# EAGLE design IOR8 (EAGLE 6.5.0)
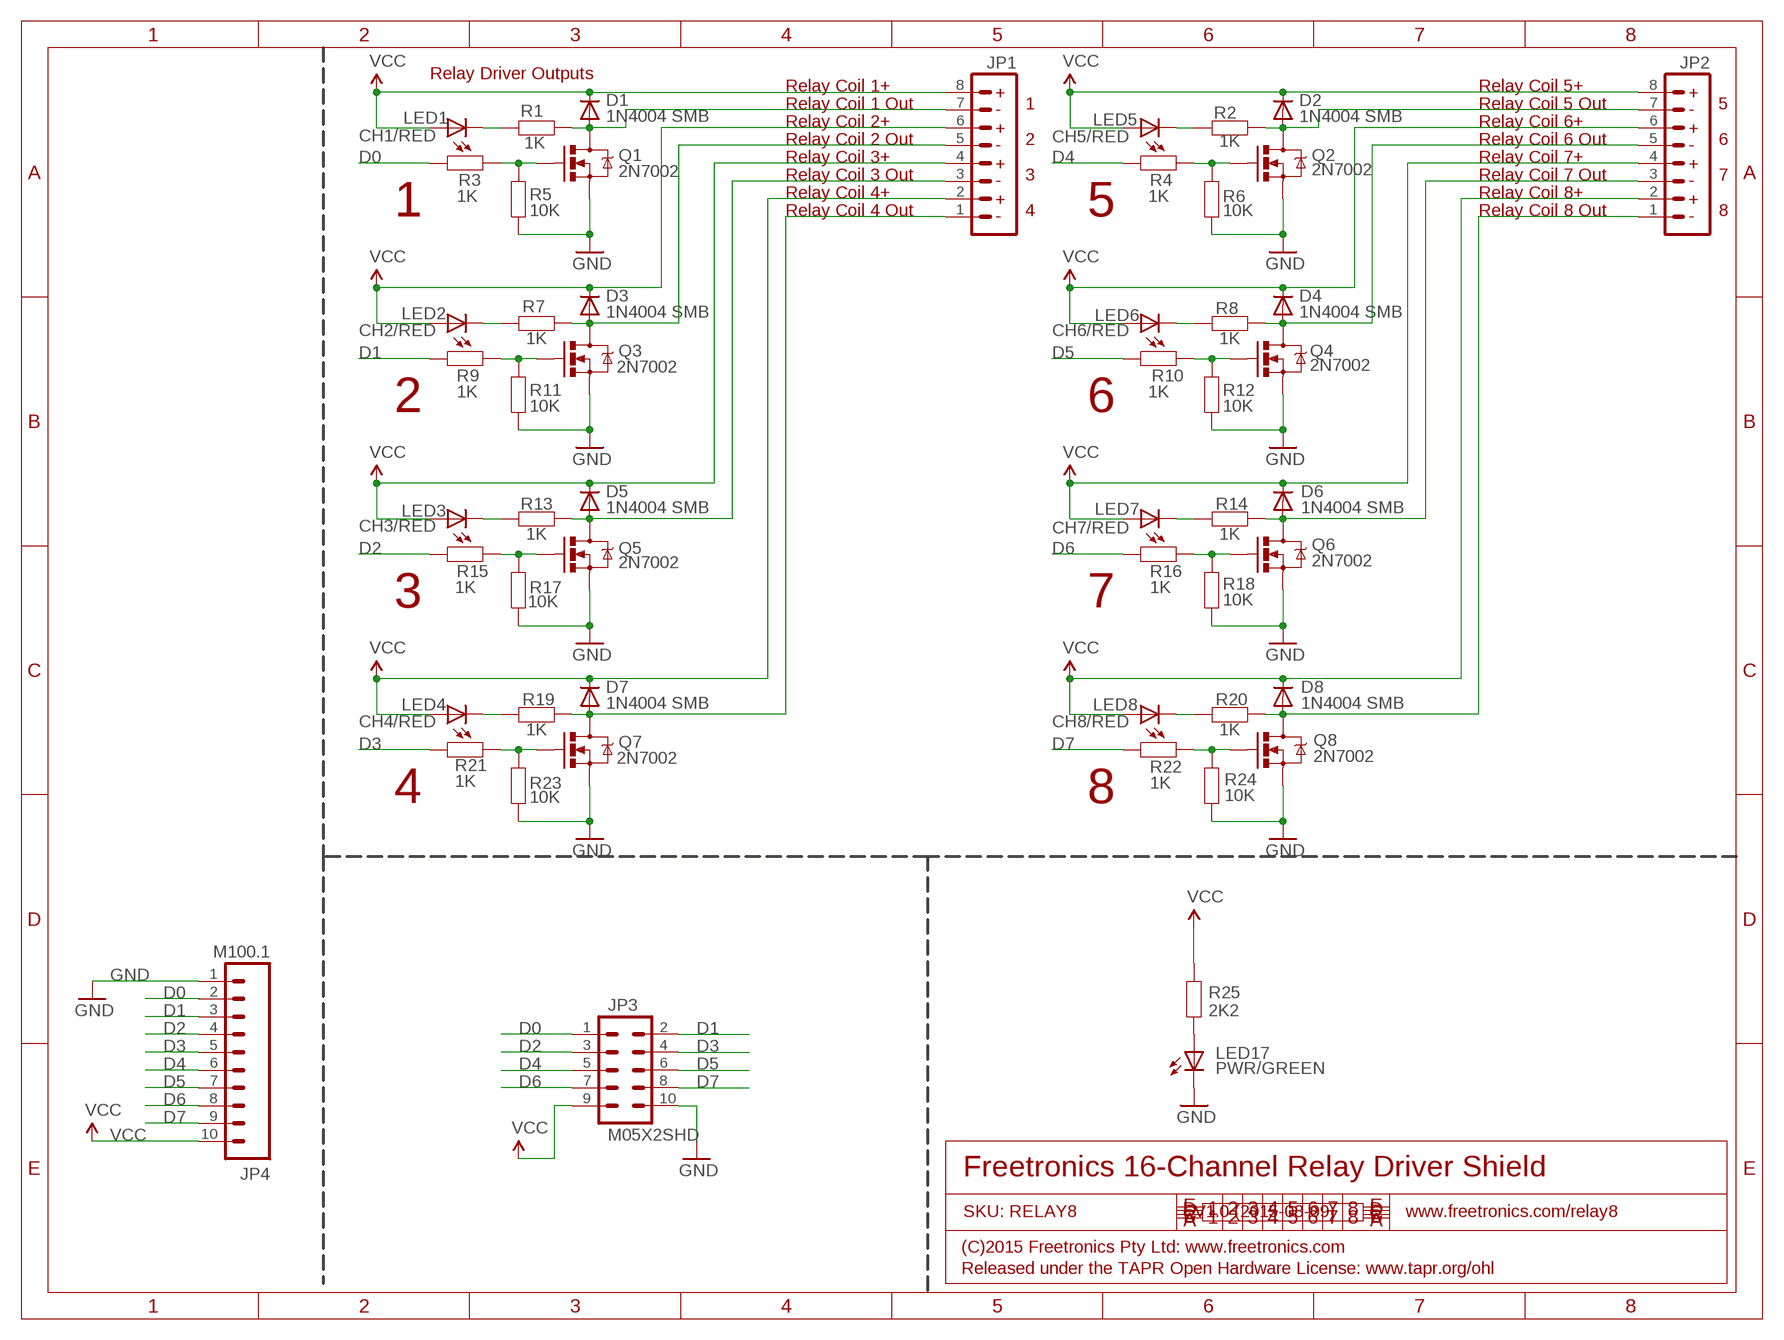
[diagram p0: schematic, sheet 1]

## Parts
D1  1N4004 SMB  DIODESMB  [SMB-DIODE]
D2  1N4004 SMB  DIODESMB  [SMB-DIODE]
D3  1N4004 SMB  DIODESMB  [SMB-DIODE]
D4  1N4004 SMB  DIODESMB  [SMB-DIODE]
D5  1N4004 SMB  DIODESMB  [SMB-DIODE]
D6  1N4004 SMB  DIODESMB  [SMB-DIODE]
D7  1N4004 SMB  DIODESMB  [SMB-DIODE]
D8  1N4004 SMB  DIODESMB  [SMB-DIODE]
JP1  M08  [TERMINALBLOCK_3.5MM_8]
JP2  M08  [TERMINALBLOCK_3.5MM_8]
JP3  M05X2SHD  [2X5-SHROUDED]
JP4  M100.1  [1X10]
LED1  CH1/RED  LED0603  [LED-0603]
LED2  CH2/RED  LED0603  [LED-0603]
LED3  CH3/RED  LED0603  [LED-0603]
LED4  CH4/RED  LED0603  [LED-0603]
LED5  CH5/RED  LED0603  [LED-0603]
LED6  CH6/RED  LED0603  [LED-0603]
LED7  CH7/RED  LED0603  [LED-0603]
LED8  CH8/RED  LED0603  [LED-0603]
LED17  PWR/GREEN  LED0603  [LED-0603]
Q1  2N7002  MOSFET-NCHANNELSMD  [SOT23-3]
Q2  2N7002  MOSFET-NCHANNELSMD  [SOT23-3]
Q3  2N7002  MOSFET-NCHANNELSMD  [SOT23-3]
Q4  2N7002  MOSFET-NCHANNELSMD  [SOT23-3]
Q5  2N7002  MOSFET-NCHANNELSMD  [SOT23-3]
Q6  2N7002  MOSFET-NCHANNELSMD  [SOT23-3]
Q7  2N7002  MOSFET-NCHANNELSMD  [SOT23-3]
Q8  2N7002  MOSFET-NCHANNELSMD  [SOT23-3]
R1  1K  RESISTOR0603  [0603]
R2  1K  RESISTOR0603  [0603]
R3  1K  RESISTOR0603  [0603]
R4  1K  RESISTOR0603  [0603]
R5  10K  RESISTOR0603  [0603]
R6  10K  RESISTOR0603  [0603]
R7  1K  RESISTOR0603  [0603]
R8  1K  RESISTOR0603  [0603]
R9  1K  RESISTOR0603  [0603]
R10  1K  RESISTOR0603  [0603]
R11  10K  RESISTOR0603  [0603]
R12  10K  RESISTOR0603  [0603]
R13  1K  RESISTOR0603  [0603]
R14  1K  RESISTOR0603  [0603]
R15  1K  RESISTOR0603  [0603]
R16  1K  RESISTOR0603  [0603]
R17  10K  RESISTOR0603  [0603]
R18  10K  RESISTOR0603  [0603]
R19  1K  RESISTOR0603  [0603]
R20  1K  RESISTOR0603  [0603]
R21  1K  RESISTOR0603  [0603]
R22  1K  RESISTOR0603  [0603]
R23  10K  RESISTOR0603  [0603]
R24  10K  RESISTOR0603  [0603]
R25  2K2  RESISTOR0603  [0603]

## Nets
D0: JP3.1 JP4.2 R3.2
D1: JP3.2 JP4.3 R9.2
D2: JP3.3 JP4.4 R15.2
D3: JP3.4 JP4.5 R21.2
D4: JP3.5 JP4.6 R4.2
D5: JP3.6 JP4.7 R10.2
D6: JP3.7 JP4.8 R16.2
D7: JP3.8 JP4.9 R22.2
GND: JP3.10 JP4.1 LED17.C Q1.2(S) Q2.2(S) Q3.2(S) Q4.2(S) Q5.2(S) Q6.2(S) Q7.2(S) Q8.2(S) R5.1 R6.1 R11.1 R12.1 R17.1 R18.1 R23.1 R24.1
N$1: Q1.1(G) R3.1 R5.2
N$3: D3.A JP1.5 Q3.3(D) R7.2
N$4: LED17.A R25.1
N$5: D1.A JP1.7 Q1.3(D) R1.2
N$8: Q3.1(G) R9.1 R11.2
N$9: D5.A JP1.3 Q5.3(D) R13.2
N$10: Q5.1(G) R15.1 R17.2
N$11: D7.A JP1.1 Q7.3(D) R19.2
N$12: Q7.1(G) R21.1 R23.2
N$13: D2.A JP2.7 Q2.3(D) R2.2
N$14: Q2.1(G) R4.1 R6.2
N$15: D4.A JP2.5 Q4.3(D) R8.2
N$16: Q4.1(G) R10.1 R12.2
N$17: D6.A JP2.3 Q6.3(D) R14.2
N$18: Q6.1(G) R16.1 R18.2
N$19: D8.A JP2.1 Q8.3(D) R20.2
N$20: Q8.1(G) R22.1 R24.2
N$21: LED2.C R7.1
N$22: LED4.C R19.1
N$23: LED3.C R13.1
N$24: LED1.C R1.1
N$25: LED5.C R2.1
N$26: LED6.C R8.1
N$27: LED7.C R14.1
N$28: LED8.C R20.1
VCC: D1.C D2.C D3.C D4.C D5.C D6.C D7.C D8.C JP1.2 JP1.4 JP1.6 JP1.8 JP2.2 JP2.4 JP2.6 JP2.8 JP3.9 JP4.10 LED1.A LED2.A LED3.A LED4.A LED5.A LED6.A LED7.A LED8.A R25.2

## Notes on the sheet
- Relay Driver Outputs
- Relay Coil 1+ | Relay Coil 5+
- + | +
- Relay Coil 1 Out | 1 | Relay Coil 5 Out | 5
- - | -
- Relay Coil 2+ | Relay Coil 6+
- + | +
- Relay Coil 2 Out | 2 | Relay Coil 6 Out | 6
- - | -
- Relay Coil 3+ | Relay Coil 7+
- + | +
- Relay Coil 3 Out | 3 | Relay Coil 7 Out | 7
- - | -
- Relay Coil 4+ | Relay Coil 8+
- + | +
- 1 | Relay Coil 4 Out | 4 | 5 | Relay Coil 8 Out | 8
- - | -
- 2 | 6
- 3 | 7
- 4 | 8
- Freetronics 16-Channel Relay Driver Shield
- SKU: RELAY8 | V1.0 (2015-03-09) | www.freetronics.com/relay8
- (C)2015 Freetronics Pty Ltd: www.freetronics.com
- Released under the TAPR Open Hardware License: www.tapr.org/ohl

## Library data of the parts
D1-D8 = freetronics-master-v1.1:DIODE: Diode These are standard reverse protection diodes and small signal diodes. SMA package can handle up to about 1A. SOD-323 can handle about 200mA. What the SOD-323 package when ordering, there are some mfgs out there that are 5-pin packages.
JP1 JP2 = freetronics-master-v1:M08: Header 8 Standard 8-pin 0.1" header. Use with straight break away headers (SKU : PRT-00116), right angle break away headers (PRT-00553), swiss pins (PRT-00743), machine pins (PRT-00117), and female headers (PRT-00115).
JP3 = freetronics-original:M05X2: Header 5x2 Standard 10-pin dual row 0.1" header. Commonly used with AVR-ISP. Use with Spark Fun Electronics SKU: PRT-00778
JP4 = freetronics-original:M10: Header 10 Standard 10-pin 0.1" header. Use with straight break away headers (SKU : PRT-00116), right angle break away headers (PRT-00553), swiss pins (PRT-00743), machine pins (PRT-00117), and female headers (PRT-00115).
LED1-LED8 LED17 = freetronics-master-v1:LED: LEDs Standard schematic elements and footprints for 5mm, 3mm, 1206, and 0603 sized LEDs. 5mm - Spark Fun Electronics SKU : COM-00529 (and others)
Q1-Q8 = freetronics-master-v1:MOSFET-NCHANNEL
R1-R25 = freetronics-master-v1:RESISTOR: Resistor Basic schematic elements and footprints for 0603, 1206, and PTH 1/10th watt (small) resistors.

## Board
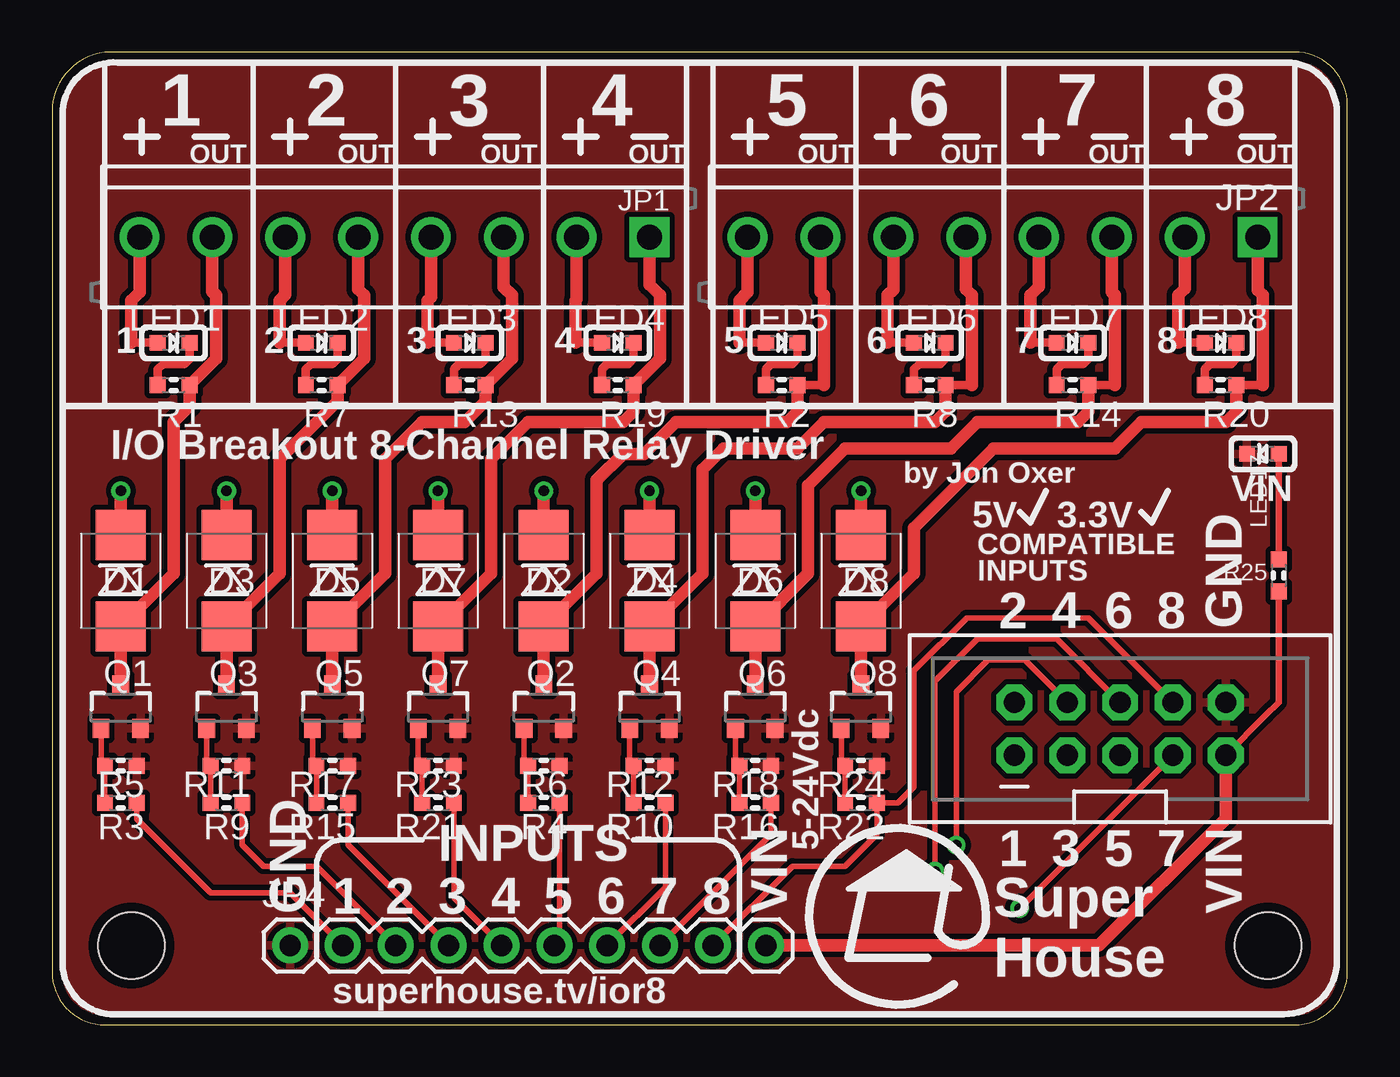
[diagram p1: board, top side]
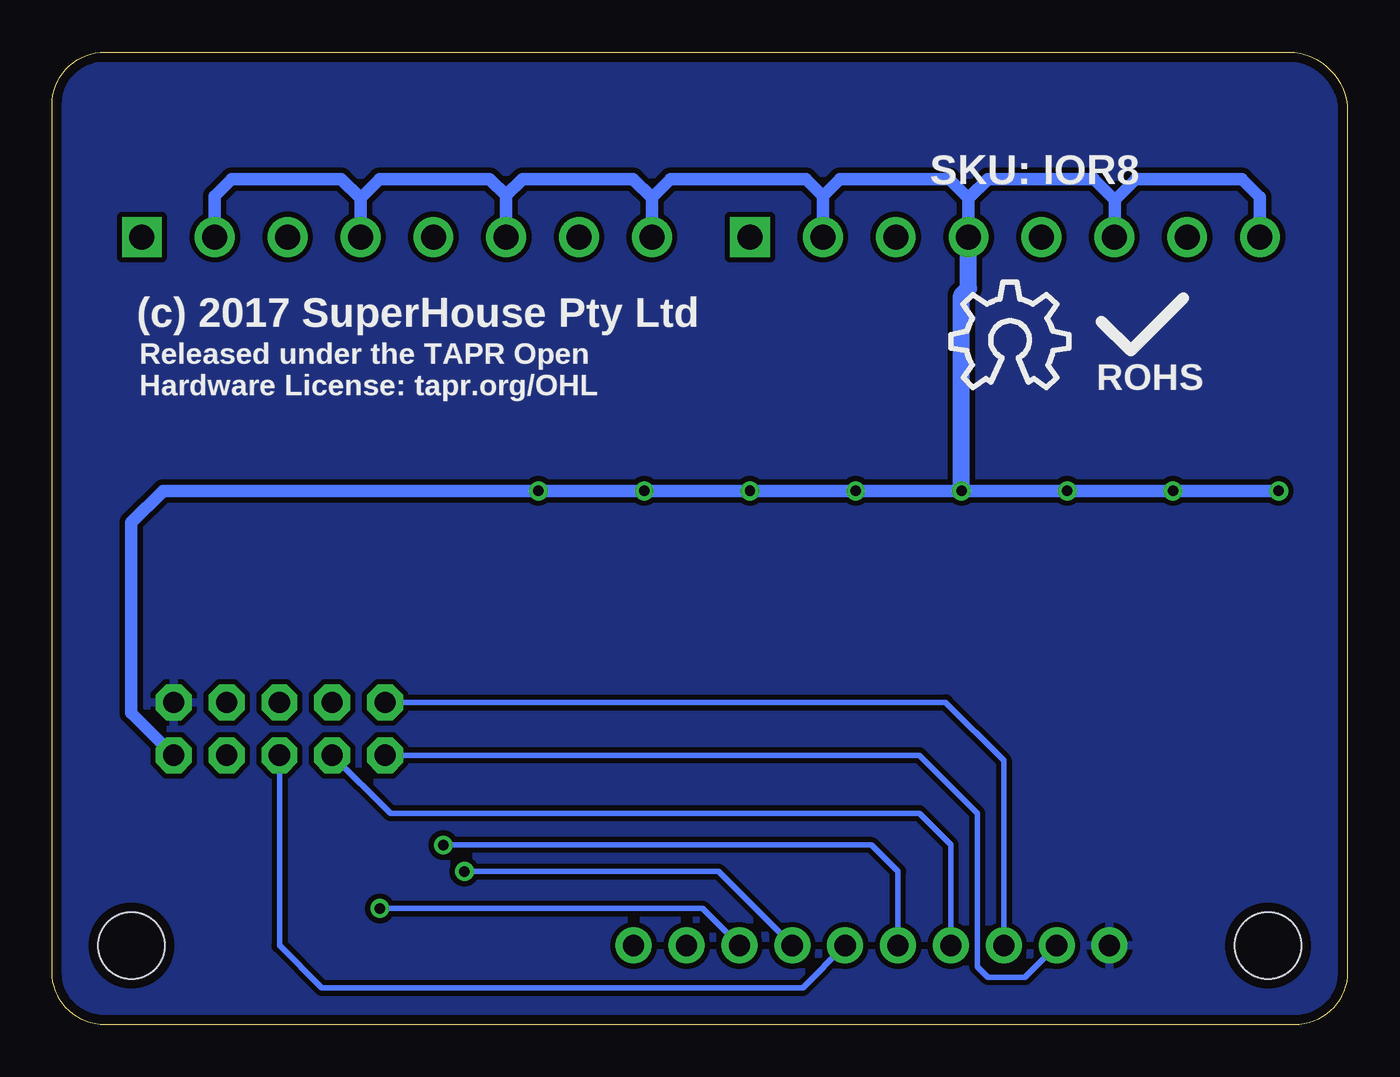
[diagram p2: board, bottom side, seen from below]

Size 62.23 x 46.74 mm. Coordinates in mm from the lower left corner, seen from the top.
Outline: 0,2.54 arc90 2.54,0 59.69,0 arc90 62.23,2.54 62.23,44.2 arc90 59.69,46.74 2.54,46.74 arc74 0,44.2 0,2.54
Copper layers (1*16): Top 0.035mm / dielectric 1.5mm / Bottom 0.035mm
Design rules "default *": minimum track width 10mil, minimum drill 19mil, track to track 10mil, track to pad 12mil, pad to pad 12mil, via to via 12mil, smd to smd 8mil, copper to edge 18mil, drill to drill 8mil, minimum pad ring 14mil, minimum via ring 8mil, stop-mask expansion 4mil, vias tented up to drill 0mil, thermal gap 10mil
Holes 3.2 mm at 3.81,3.81 58.42,3.81

### Footprints (pad centres in the part's own frame; a part is rotated, then mirrored left to right if it is on the bottom)
SMB-DIODE = smd 2.4 x 2.4: A 2.2,0; C -2.2,0
TERMINALBLOCK_3.5MM_8 = drill 1.2 square: 1 0,0 | drill 1.2: 2 3.5,0; 3 7,0; 4 10.5,0; 5 14,0; 6 17.5,0; 7 21,0; 8 24.5,0
2X5-SHROUDED = drill 1.016 octagon: 1 -1.27,5.08; 2 1.27,5.08; 3 -1.27,2.54; 4 1.27,2.54; 5 -1.27,0; 6 1.27,0; 7 -1.27,-2.54; 8 1.27,-2.54; 9 -1.27,-5.08; 10 1.27,-5.08
1X10 = drill 1.016: 1 0,0; 2 2.54,0; 3 5.08,0; 4 7.62,0; 5 10.16,0; 6 12.7,0; 7 15.24,0; 8 17.78,0; 9 20.32,0; 10 22.86,0
LED-0603 = smd 0.762 x 0.762: A -0.762,0; C 0.762,0
SOT23-3 = smd 0.8 x 0.9: 1 -0.95,-1; 2 0.95,-1; 3 0,1.1
0603 = smd 0.762 x 0.762: 1 -0.762,0; 2 0.762,0

### Placement (x,y rotation side)
D1  3.3,21.34 270 top
D2  23.62,21.34 270 top
D3  8.38,21.34 270 top
D4  28.7,21.34 270 top
D5  13.46,21.34 270 top
D6  33.78,21.34 270 top
D7  18.54,21.34 270 top
D8  38.86,21.34 270 top
JP1  28.7,37.85 180 top
JP2  57.91,37.85 180 top
JP3  51.31,14.22 90 top
JP4  11.43,3.81 0 top
LED1  5.84,32.77 0 top
LED2  12.95,32.77 0 top
LED3  20.07,32.77 0 top
LED4  27.18,32.77 0 top
LED5  35.05,32.77 0 top
LED6  42.16,32.77 0 top
LED7  49.02,32.77 0 top
LED8  56.13,32.77 0 top
LED17  58.17,27.43 180 top
Q1  3.3,15.24 0 top
Q2  23.62,15.24 0 top
Q3  8.38,15.24 0 top
Q4  28.7,15.24 0 top
Q5  13.46,15.24 0 top
Q6  33.78,15.24 0 top
Q7  18.54,15.24 0 top
Q8  38.86,15.24 0 top
R1  5.84,30.73 0 top
R2  35.05,30.73 0 top
R3  3.3,10.67 0 top
R4  23.62,10.67 0 top
R5  3.3,12.45 180 top
R6  23.62,12.45 180 top
R7  12.95,30.73 0 top
R8  42.16,30.73 0 top
R9  8.38,10.67 0 top
R10  28.7,10.67 0 top
R11  8.38,12.45 180 top
R12  28.7,12.45 180 top
R13  20.07,30.73 0 top
R14  49.02,30.73 0 top
R15  13.46,10.67 0 top
R16  33.78,10.67 0 top
R17  13.46,12.45 180 top
R18  33.78,12.45 180 top
R19  27.18,30.73 0 top
R20  56.13,30.73 0 top
R21  18.54,10.67 0 top
R22  38.86,10.67 0 top
R23  18.54,12.45 180 top
R24  38.86,12.45 180 top
R25  58.93,21.59 270 top
U$6  [OSHW_10X200_NOTEXT]  19.05,30.61 0 bottom

### Tracks (layer width: path | path; a pad name or v marks a point on that pad's centre or on a via)
D0
  Top 0.254: JP4.2 11.43,6.35 7.62,6.35 4.06,9.91 R3.2
  Bottom 0.254: JP4.2 15.49,2.29 17.27,2.29 17.78,2.79 17.78,10.16 20.57,12.95 JP3.1
D1
  Top 0.254: JP4.3 12.7,7.62 10.16,7.62 9.14,8.64 R9.2
  Bottom 0.254: JP3.2 19.3,15.49 16.51,12.7 JP4.3
D2
  Top 0.254: JP4.4 14.22,8.64 R15.2
  Bottom 0.254: JP4.4 19.05,8.64 20.57,10.16 45.97,10.16 JP3.3
D3  (via drill 0.5)
  Top 0.254: JP4.5 19.3,6.1 R21.2 | v43.43,8.64 43.43,16 44.96,17.53 46.74,17.53 JP3.4
  Bottom 0.254: JP4.5 21.59,7.37 22.86,8.64 v43.43,8.64
D4
  Top 0.254: JP4.6 24.38,4.06 R4.2
  Bottom 0.254: JP3.5 51.31,3.81 49.28,1.78 26.16,1.78 JP4.6
D5  (via drill 0.5)
  Top 0.254: JP4.7 29.46,6.6 R10.2 | JP3.6 48.26,18.54 44.45,18.54 42.42,16.51 v42.42,7.37
  Bottom 0.254: v42.42,7.37 30.23,7.37 JP4.7
D6  (via drill 0.5)
  Top 0.254: JP4.8 34.54,9.14 R16.2 | JP3.7 v46.48,5.59
  Bottom 0.254: v46.48,5.59 30.99,5.59 JP4.8
D7
  Top 0.254: JP4.9 35.56,7.62 38.1,7.62 39.62,9.14 R22.2 40.64,10.67 41.4,11.43 41.4,17.02 43.94,19.56 49.78,19.56 JP3.8
GND
  pour Bottom: 0,44.2 arc-74 2.54,46.74 59.69,46.74 arc-74 62.23,44.2 62.23,2.54 arc-74 59.69,0 2.54,0 arc-90 0,2.54
  pour Top: 0,44.2 arc-74 2.54,46.74 59.69,46.74 arc-74 62.23,44.2 62.23,2.54 arc-74 59.69,0 2.54,0 arc-90 0,2.54
N$1
  Top 0.254: R3.1 R5.2 2.35,12.63 Q1.1
  Top 0.406: 2.29,14.17 Q1.1
N$3
  Top 0.61: Q3.3 D3.A | D3.A 8.38,19.3 | JP1.5 14.7,35.34 14.99,35.05 14.99,32 R7.2 13.72,29.97 10.92,27.18 10.92,21.68 D3.A
N$4
  Top 0.305: R25.1 LED17.A
N$5
  Top 0.61: JP1.7 7.7,35.22 7.87,35.05 7.87,32 R1.2 6.6,29.72 5.84,28.96 5.84,21.68 D1.A Q1.3
N$8
  Top 0.254: R9.1 R11.2 7.43,12.63 Q3.1
  Top 0.406: 7.37,14.17 Q3.1
N$9
  Top 0.61: Q5.3 D5.A | D5.A 13.46,19.3 | JP1.3 21.7,35.45 22.1,35.05 22.1,32 R13.2 20.83,29.97 19.81,28.96 17.78,28.96 16,27.18 16,21.68 D5.A
N$10
  Top 0.254: R15.1 R17.2 12.51,12.63 Q5.1
  Top 0.406: 12.45,14.17 Q5.1
N$11
  Top 0.61: Q7.3 D7.A | D7.A 18.54,19.3 | JP1.1 28.7,35.56 29.21,35.05 29.21,32 R19.2 27.94,29.46 27.43,28.96 22.86,28.96 21.08,27.18 21.08,21.68 D7.A
N$12
  Top 0.254: R21.1 R23.2 17.59,12.63 Q7.1
  Top 0.406: 17.53,14.17 Q7.1
N$13
  Top 0.406: 37.08,30.73 R2.2
  Top 0.61: 37.08,30.73 37.08,35.05 36.91,35.22 JP2.7 | Q2.3 D2.A 26.16,21.68 26.16,26.16 27.43,27.43 28.45,27.43 29.97,28.96 35.31,28.96 35.81,29.46 R2.2
N$14
  Top 0.254: R4.1 R6.2 22.67,12.63 Q2.1
N$15
  Top 0.406: 44.2,30.73 R8.2
  Top 0.61: 44.2,30.73 44.2,35.05 43.91,35.34 JP2.5 | Q4.3 D4.A 31.24,21.68 31.24,26.67 32.26,27.69 35.81,27.69 37.08,28.96 42.42,28.96 42.93,29.46 R8.2
N$16
  Top 0.254: R10.1 R12.2 27.75,12.63 Q4.1
N$17
  Top 0.406: 51.05,30.73 R14.2
  Top 0.61: Q6.3 D6.A | 51.05,30.73 51.05,35.05 50.91,35.19 JP2.3 | D6.A 33.87,19.14 | D6.A 36.32,21.68 36.32,25.91 38.1,27.69 43.18,27.69 44.45,28.96 49.28,28.96 49.78,29.46 R14.2
N$18
  Top 0.254: R16.1 R18.2 32.83,12.63 Q6.1
N$19
  Top 0.406: 58.17,30.73 R20.2
  Top 0.61: Q8.3 D8.A | 58.17,30.73 58.17,35.05 57.91,35.31 JP2.1 | D8.A 38.95,19.14 | D8.A 41.4,21.68 41.4,23.88 45.21,27.69 51.05,27.69 52.32,28.96 56.39,28.96 56.9,29.46 R20.2
N$20
  Top 0.254: R22.1 R24.2 37.91,12.63 Q8.1
N$21
  Top 0.406: R7.1 12.19,31.5 12.45,31.75 13.46,31.75 13.72,32 LED2.C
N$22
  Top 0.406: R19.1 26.42,31.5 26.67,31.75 27.69,31.75 27.94,32 LED4.C
N$23
  Top 0.406: R13.1 19.3,31.5 19.56,31.75 20.57,31.75 20.83,32 LED3.C
N$24
  Top 0.406: R1.1 5.08,31.5 5.33,31.75 6.35,31.75 6.6,32 LED1.C
N$25
  Top 0.406: R2.1 34.29,31.5 34.54,31.75 35.56,31.75 35.81,32 LED5.C
N$26
  Top 0.406: R8.1 41.4,31.5 41.66,31.75 42.67,31.75 42.93,32 LED6.C
N$27
  Top 0.406: R14.1 48.26,31.5 48.51,31.75 49.53,31.75 49.78,32 LED7.C
N$28
  Top 0.406: R20.1 55.37,31.5 55.63,31.75 56.64,31.75 56.9,32 LED8.C
VCC  (via drill 0.5)
  Top 0.254: 11.18,37.87 JP1.6
  Top 0.305: JP3.9 58.29,14.86 58.93,15.49 R25.2
  Top 0.406: 25.15,32.77 LED4.A | 18.03,32.77 LED3.A | 10.92,32.77 LED2.A | 3.81,32.77 LED1.A | 33.02,32.77 LED5.A | 40.13,32.77 LED6.A | 46.99,32.77 LED7.A | 54.1,32.77 LED8.A
  Top 0.61: 25.15,32.77 25.15,34.8 25.2,34.85 JP1.2 | 18.03,32.77 18.03,34.8 18.2,34.97 JP1.4 | 10.92,32.77 10.92,34.8 11.2,35.08 JP1.6 | 3.81,32.77 3.81,34.8 4.2,35.19 JP1.8 | 33.02,32.77 33.02,34.8 33.41,35.19 JP2.8 | 40.13,32.77 40.13,35.05 40.41,35.33 JP2.6 | 46.99,32.77 46.99,35.05 47.41,35.47 JP2.4 | 54.1,32.77 54.1,35.05 54.41,35.36 JP2.2 | v38.86,25.65 D8.C | v3.3,25.65 D1.C | v8.38,25.65 D3.C | v13.46,25.65 D5.C | v18.54,25.65 D7.C | v23.62,25.65 D2.C | v28.7,25.65 D4.C | v33.78,25.65 D6.C | JP4.10 50.29,3.81 56.39,9.91 JP3.9
  Bottom 0.254: 11.18,37.87 JP1.6
  Bottom 0.61: 11.18,39.62 10.16,40.64 5.08,40.64 4.2,39.76 JP1.8 | 11.18,39.62 11.18,37.87 | 18.2,39.71 17.27,40.64 12.19,40.64 11.18,39.62 | 25.2,39.82 24.38,40.64 19.13,40.64 18.2,39.71 | 33.41,39.74 32.51,40.64 26.02,40.64 25.2,39.82 | 40.41,39.85 39.62,40.64 34.31,40.64 33.41,39.74 | 47.41,39.71 46.48,40.64 41.2,40.64 40.41,39.85 | JP2.2 54.41,39.82 53.59,40.64 48.34,40.64 47.41,39.71 | v3.3,25.65 v8.38,25.65 v13.46,25.65 v18.54,25.65 v23.62,25.65 v28.7,25.65 v33.78,25.65 v38.86,25.65 56.9,25.65 58.42,24.13 58.42,14.99 JP3.9 | 18.2,39.71 JP1.4 | 25.2,39.82 JP1.2 | 33.41,39.74 JP2.8 | 40.41,39.85 JP2.6 | 47.41,39.71 JP2.4
  Bottom 0.813: v18.54,25.65 18.54,35.05 18.2,35.39 JP1.4

### Text on the board
tPlace: 1 | 2 | 3 | 4 | 5 | 6 | 7 | 8 | OUT | OUT | OUT | OUT | OUT | OUT | OUT | OUT | 1 | 2 | 3 | 4 | 5 | 6 | 7 | 8 | I/O Breakout 8-Channel Relay Driver | by Jon Oxer | VIN | 5V | 3.3V | COMPATIBLE | INPUTS | 2 | 4 | 6 | 8 | GND | INPUTS | 5-24Vdc | 1 | 3 | 5 | 7 | GND | 1 | 2 | 3 | 4 | 5 | 6 | 7 | 8 | VIN | VIN | Super / House | superhouse.tv/ior8
bPlace: SKU: IOR8 | (c) 2017 SuperHouse Pty Ltd | ROHS | Released under the TAPR Open / Hardware License: tapr.org/OHL
tDocu: A | K | A | K | A | K | A | K | A | K | A | K | A | K | A | K | K | A